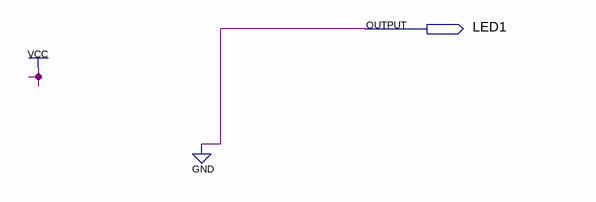
[diagram p0: schematic sheet]
// Quartus schematic Test.bdf as structural Verilog: 0 symbols, 1 pins
module Test (
  output LED1
);


  assign LED1 = 1'b0;
endmodule
